# Altium schematic sheet MiniHeating.SchDoc
size A4
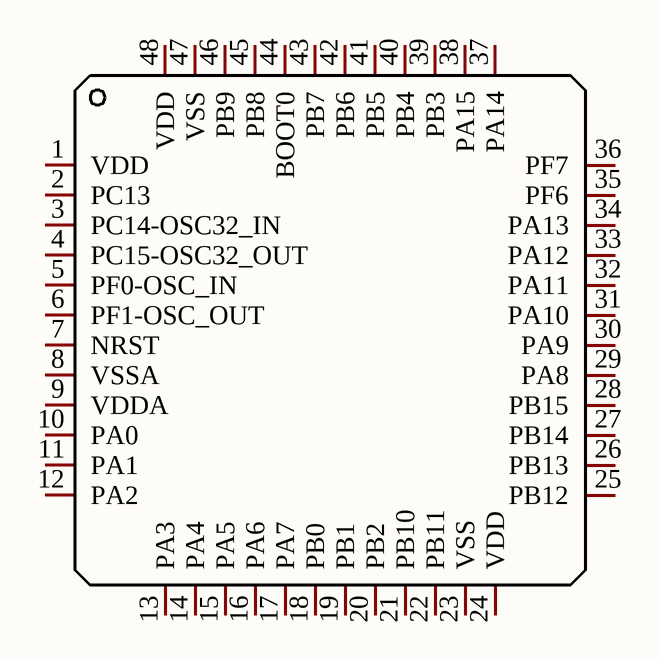
[diagram p0: MiniHeating.SchDoc]

## Parts
U??  CW32F030C8T6_C3019113  [LQFP-48_L7.0-W7.0-P0.50-LS9.0-TL]  (value not drawn)

## Nets

Not connected (* = marked no-connect by the designer): U?? 1(VDD) 2(PC13) 3(PC14-OSC32_IN) 4(PC15-OSC32_OUT) 5(PF0-OSC_IN) 6(PF1-OSC_OUT) 7(NRST) 8(VSSA) 9(VDDA) 10(PA0) 11(PA1) 12(PA2) 13(PA3) 14(PA4) 15(PA5) 16(PA6) 17(PA7) 18(PB0) 19(PB1) 20(PB2) 21(PB10) 22(PB11) 23(VSS) 24(VDD) 25(PB12) 26(PB13) 27(PB14) 28(PB15) 29(PA8) 30(PA9) 31(PA10) 32(PA11) 33(PA12) 34(PA13) 35(PF6) 36(PF7) 37(PA14) 38(PA15) 39(PB3) 40(PB4) 41(PB5) 42(PB6) 43(PB7) 44(BOOT0) 45(PB8) 46(PB9) 47(VSS) 48(VDD)

## Library data of the parts
U?? = CW32F030C8T6_C3019113: ARM Cortex-M0+ 64MHz RAM：8KB; Manufacturer: CW(芯源); Add into BOM: yes; Supply Voltage Range: 1.65V~5.5V; Internal Oscillator: 有; External Clock Frequency Rang: 4MHz~32MHz; RAM Size: 8KB; GPIO Ports Number: 39; ADC (Units/Channels/bits): 1@x16ch/12bit; 16Bit Timer Number: 8; CMP Number: 2; U(S)ART Number: 3; Peripherals / Functions / Protocol Stacks: 片载温度传感器；DMA；看门狗；低电压检测；CRC校验; Name: CW32F030C8T6; Symbol: CW32F030C8T6_C3019113; Device: CW32F030C8T6_C3019113; LCSC Part Name: ARM Cortex-M0+ 64MHz RAM：8KB; Supplier Part: C3019113; Manufacturer Part: CW32F030C8T6; Supplier Footprint: LQFP-48; JLCPCB Part Class: Extended Part; Datasheet: https://atta.szlcsc.com/upload/public/pdf/source/20220516/D60F5E1023A73FFF550D4A77416DDFBC.pdf; Supplier: LCSC; Convert to PCB: yes; CPU Core: ARM Cortex-M0+; Maximum Frequency: 64MHz; Program FLASH Size: -; EEPROM/Data FLASH Size: -; DAC (Units/Channels/bits): -; (E)PWM (Units/Channels/bits): -; 8Bit Timer Number: -; 32Bit Timer Number: -; I2C Number: 2; I2S Number: -; (Q)SPI Number: 2; CAN Number: -; USB (H/D/OTG): -; Operating Temperature Range: -40℃~105℃